# Altium schematic sheet 50.VO-HDMI2.1 TX.SchDoc
size 420 x 297 mm; Revision: V2.1; Schematic Page Number: 11; Page Number: 28; Check: <Checker>; Schematic Name: RK_NVR_DEMO1_RK3588_LP4/4x_V21; Page Count: 43; Page name: 50.VO-HDMI2.1 TX; Designer: Zhangdz; Schematic Page Count: 99; Revcode: V2.1; DsnPath: E:\Work\SBER\RK3588_SOM\temp\RK_NVR_DEMO1_RK3588_LP4XD200P232SD8_V21_20211228.DSN; SchematicName: RK_NVR_DEMO1_RK3588_LP4/4x_V21; PageName: 50.VO-HDMI2.1 TX; PageSize: A3; TopSchematic: True
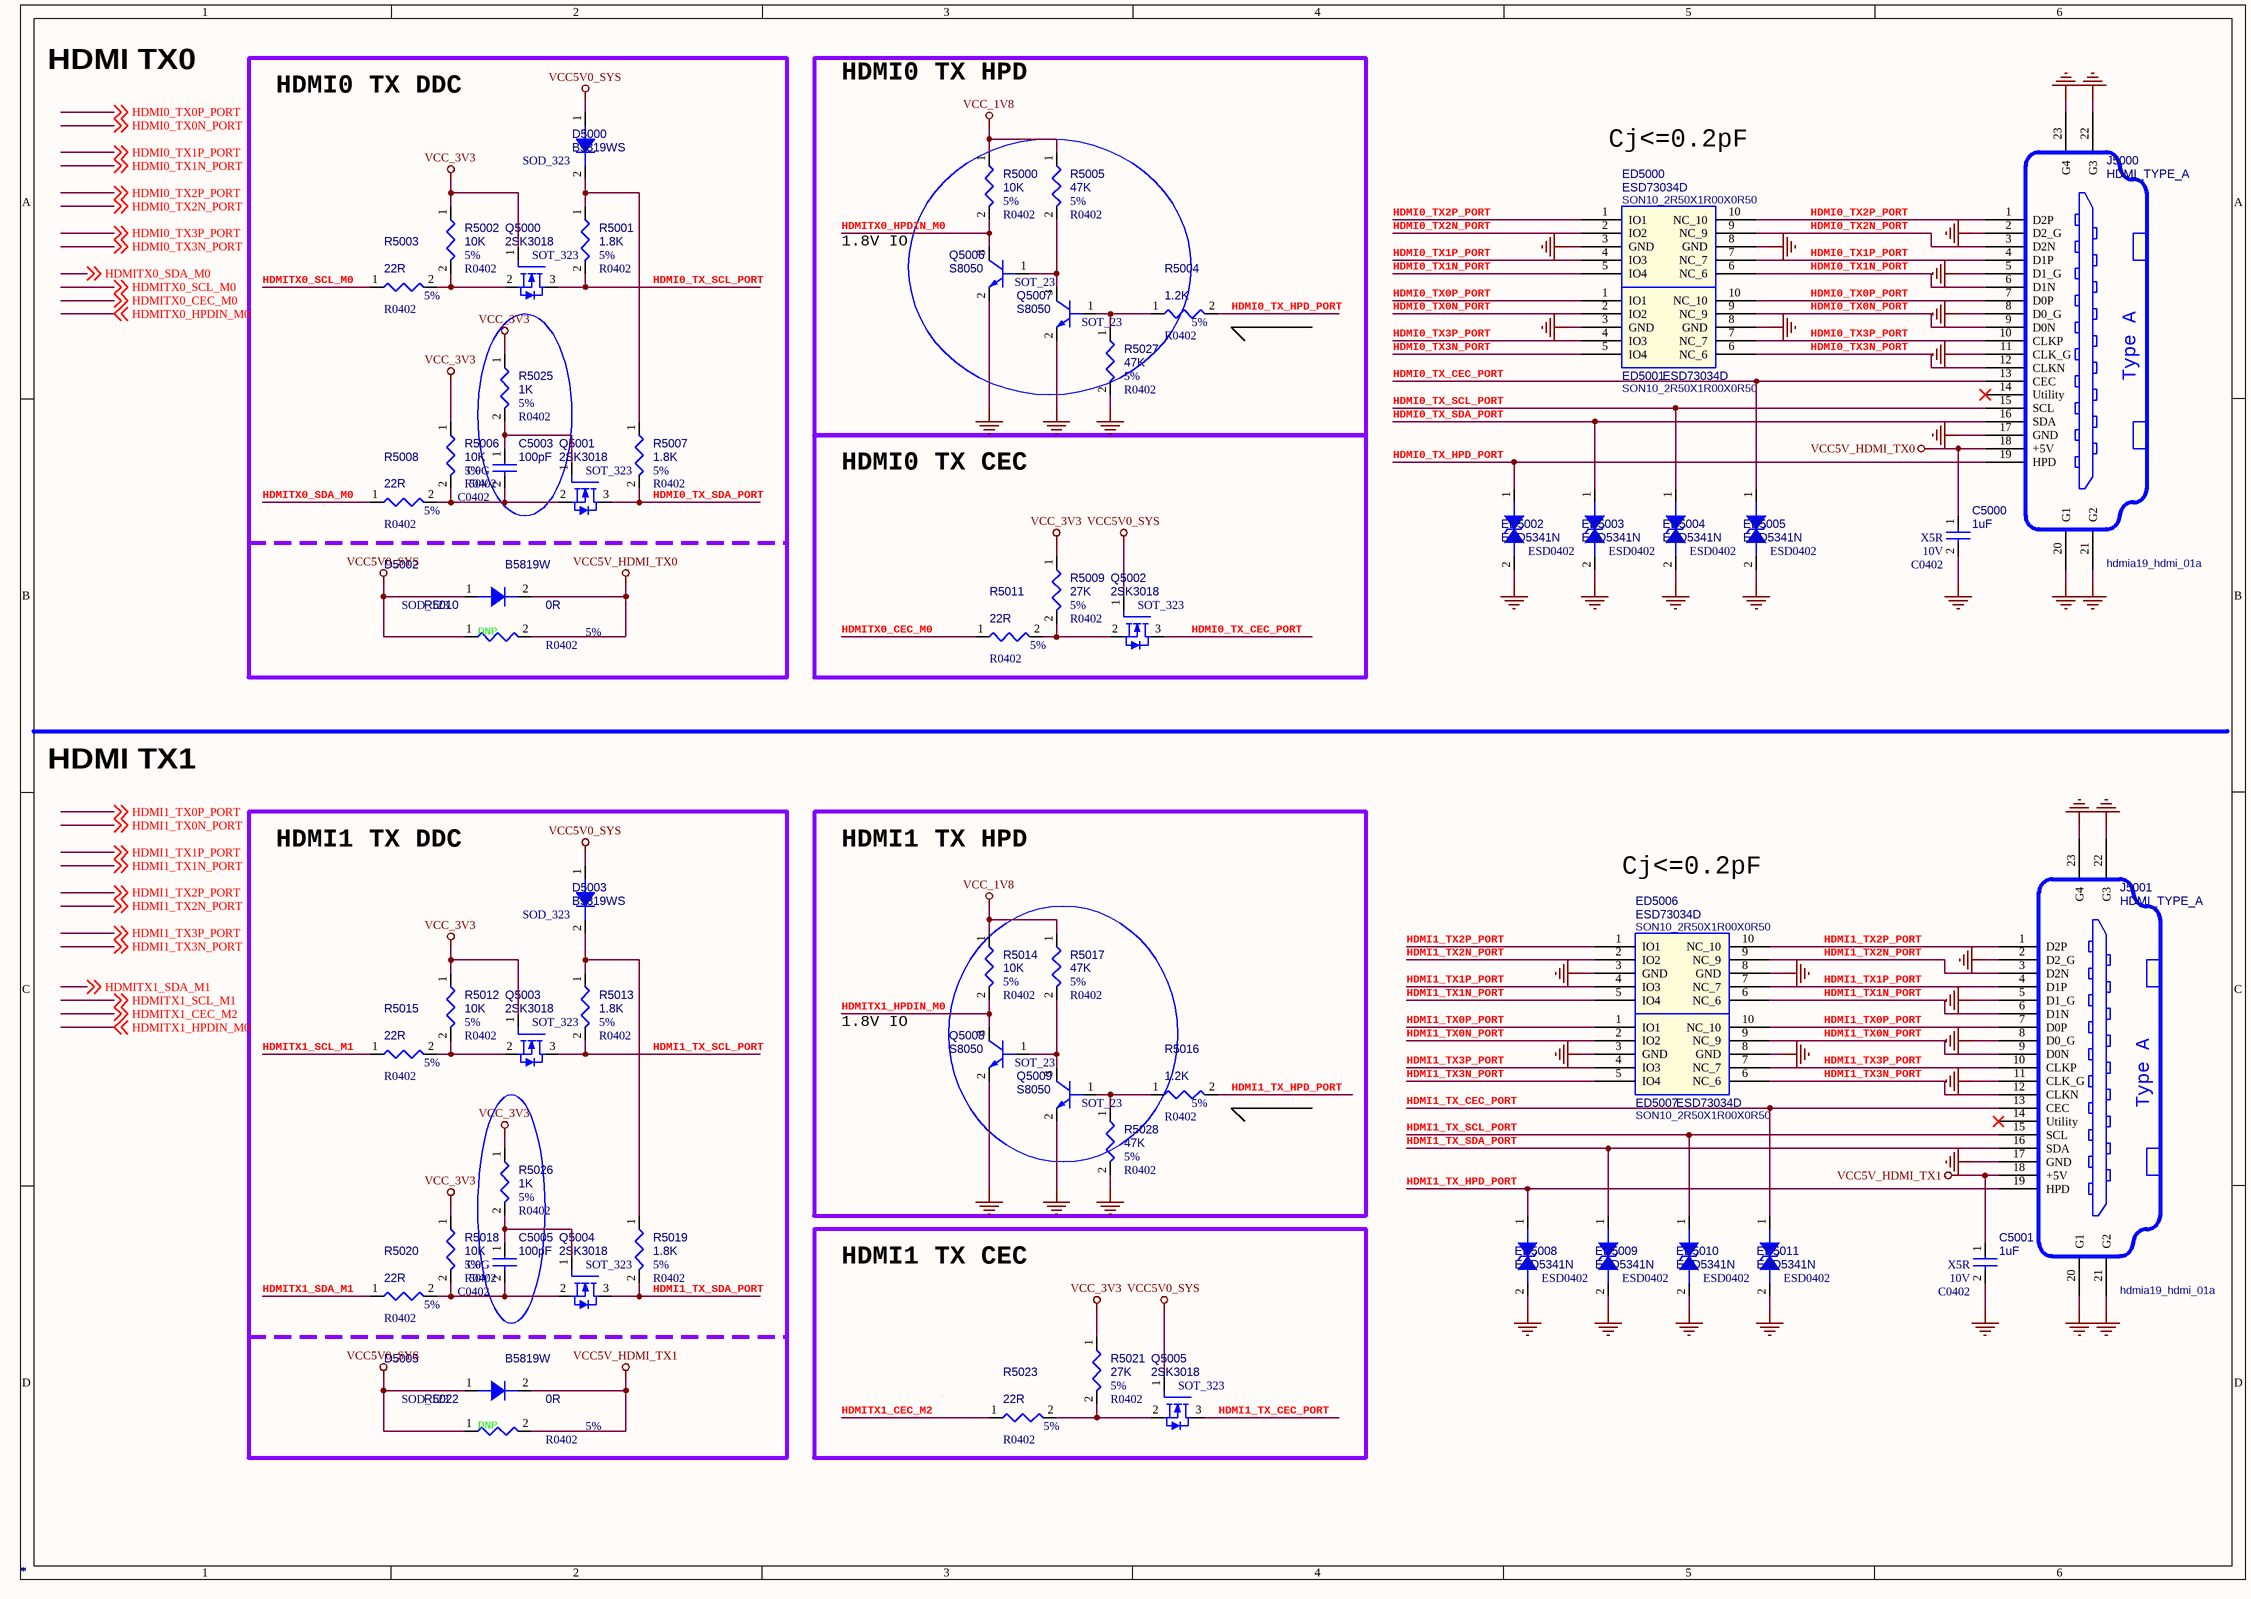
[diagram p0: 50.VO-HDMI2.1 TX.SchDoc]

## Parts
C5000  *  Voltage: 10V  Dielectric: X5R  [C0402]
C5001  *  Voltage: 10V  Dielectric: X5R  [C0402]
C5003  *  Voltage: 50V  Dielectric: C0G  [C0402]
C5005  *  Voltage: 50V  Dielectric: C0G  [C0402]
D5000  *  [SOD_323]
D5002  *  [SOD_123]
D5003  *  [SOD_323]
D5005  *  [SOD_123]
ED5000  *  [SON10_2R50X1R00X0R50]
ED5001  *  [SON10_2R50X1R00X0R50]
ED5002  *  [ESD0402]
ED5003  *  [ESD0402]
ED5004  *  [ESD0402]
ED5005  *  [ESD0402]
ED5006  *  [SON10_2R50X1R00X0R50]
ED5007  *  [SON10_2R50X1R00X0R50]
ED5008  *  [ESD0402]
ED5009  *  [ESD0402]
ED5010  *  [ESD0402]
ED5011  *  [ESD0402]
J5000  *  [hdmia19_hdmi_01a]
J5001  *  [hdmia19_hdmi_01a]
Q5000  *  PCB Footprint: SOT_323  [SOT23]
Q5001  *  PCB Footprint: SOT_323  [SOT23]
Q5002  *  PCB Footprint: SOT_323  [SOT23]
Q5003  *  PCB Footprint: SOT_323  [SOT23]
Q5004  *  PCB Footprint: SOT_323  [SOT23]
Q5005  *  PCB Footprint: SOT_323  [SOT23]
Q5006  *  [SOT_23]
Q5007  *  [SOT_23]
Q5008  *  [SOT_23]
Q5009  *  [SOT_23]
R5000  *  Tolerance: 5%  [R0402]
R5001  *  Tolerance: 5%  [R0402]
R5002  *  Tolerance: 5%  [R0402]
R5003  *  Tolerance: 5%  [R0402]
R5004  *  Tolerance: 5%  [R0402]
R5005  *  Tolerance: 5%  [R0402]
R5006  *  Tolerance: 5%  [R0402]
R5007  *  Tolerance: 5%  [R0402]
R5008  *  Tolerance: 5%  [R0402]
R5009  *  Tolerance: 5%  [R0402]
R5010  *  Tolerance: 5%  Option: DNP  [R0402]
R5011  *  Tolerance: 5%  [R0402]
R5012  *  Tolerance: 5%  [R0402]
R5013  *  Tolerance: 5%  [R0402]
R5014  *  Tolerance: 5%  [R0402]
R5015  *  Tolerance: 5%  [R0402]
R5016  *  Tolerance: 5%  [R0402]
R5017  *  Tolerance: 5%  [R0402]
R5018  *  Tolerance: 5%  [R0402]
R5019  *  Tolerance: 5%  [R0402]
R5020  *  Tolerance: 5%  [R0402]
R5021  *  Tolerance: 5%  [R0402]
R5022  *  Tolerance: 5%  Option: DNP  [R0402]
R5023  *  Tolerance: 5%  [R0402]
R5025  *  Tolerance: 5%  [R0402]
R5026  *  Tolerance: 5%  [R0402]
R5027  *  Tolerance: 5%  [R0402]
R5028  *  Tolerance: 5%  [R0402]

## Blocks framed on the sheet
HDMI0 TX DDC: C5003 D5000 D5002 Q5000 Q5001 R5001-R5003 R5006-R5008 R5010 R5025
HDMI0 TX HPD: Q5006 Q5007 R5000 R5004 R5005 R5027
HDMI0 TX CEC: Q5002 R5009 R5011
HDMI1 TX DDC: C5005 D5003 D5005 Q5003 Q5004 R5012 R5013 R5015 R5018-R5020 R5022 R5026
HDMI1 TX HPD: Q5008 Q5009 R5014 R5016 R5017 R5028
HDMI1 TX CEC: Q5005 R5021 R5023

## Nets
GND: C5000.2 C5001.2 ED5000.3(GND) ED5000.8(GND) ED5001.3(GND) ED5001.8(GND) ED5002.2 ED5003.2 ED5004.2 ED5005.2 ED5006.3(GND) ED5006.8(GND) ED5007.3(GND) ED5007.8(GND) ED5008.2 ED5009.2 ED5010.2 ED5011.2 J5000.2(D2_G) J5000.5(D1_G) J5000.8(D0_G) J5000.11(CLK_G) J5000.17(GND) J5000.20(G1) J5000.21(G2) J5000.22(G3) J5000.23(G4) J5001.2(D2_G) J5001.5(D1_G) J5001.8(D0_G) J5001.11(CLK_G) J5001.17(GND) J5001.20(G1) J5001.21(G2) J5001.22(G3) J5001.23(G4) Q5006.2(EMITTER) Q5007.2(EMITTER) Q5008.2(EMITTER) Q5009.2(EMITTER) R5027.2 R5028.2
VCC5V0_SYS: D5000.1(A) D5002.1(A) D5003.1(A) D5005.1(A) Q5002.1(GATE) Q5005.1(GATE) R5010.1 R5022.1
VCC5V_HDMI_TX0: C5000.1 D5002.2(K) J5000.18(+5V) R5010.2
VCC5V_HDMI_TX1: C5001.1 D5005.2(K) J5001.18(+5V) R5022.2
VCC_1V8: R5000.1 R5005.1 R5014.1 R5017.1
VCC_3V3: Q5000.1(GATE) Q5003.1(GATE) R5002.1 R5006.1 R5009.1 R5012.1 R5018.1 R5021.1 R5025.1 R5026.1
HDMI0_TX0N_PORT: ED5001.2(IO2) ED5001.9(NC_9) J5000.9(D0N) ; off-sheet HDMI0_TX0N_PORT
HDMI0_TX0P_PORT: ED5001.1(IO1) ED5001.10(NC_10) J5000.7(D0P) ; off-sheet HDMI0_TX0P_PORT
HDMI0_TX1N_PORT: ED5000.5(IO4) ED5000.6(NC_6) J5000.6(D1N) ; off-sheet HDMI0_TX1N_PORT
HDMI0_TX1P_PORT: ED5000.4(IO3) ED5000.7(NC_7) J5000.4(D1P) ; off-sheet HDMI0_TX1P_PORT
HDMI0_TX2N_PORT: ED5000.2(IO2) ED5000.9(NC_9) J5000.3(D2N) ; off-sheet HDMI0_TX2N_PORT
HDMI0_TX2P_PORT: ED5000.1(IO1) ED5000.10(NC_10) J5000.1(D2P) ; off-sheet HDMI0_TX2P_PORT
HDMI0_TX3N_PORT: ED5001.5(IO4) ED5001.6(NC_6) J5000.12(CLKN) ; off-sheet HDMI0_TX3N_PORT
HDMI0_TX3P_PORT: ED5001.4(IO3) ED5001.7(NC_7) J5000.10(CLKP) ; off-sheet HDMI0_TX3P_PORT
HDMI0_TX_CEC_PORT: ED5005.1 J5000.13(CEC) Q5002.3(DRAIN)
HDMI0_TX_HPD_PORT: ED5002.1 J5000.19(HPD) R5004.2
HDMI0_TX_SCL_PORT: ED5004.1 J5000.15(SCL) Q5000.3(DRAIN) R5001.2
HDMI0_TX_SDA_PORT: ED5003.1 J5000.16(SDA) Q5001.3(DRAIN) R5007.2
HDMI1_TX0N_PORT: ED5007.2(IO2) ED5007.9(NC_9) J5001.9(D0N) ; off-sheet HDMI1_TX0N_PORT
HDMI1_TX0P_PORT: ED5007.1(IO1) ED5007.10(NC_10) J5001.7(D0P) ; off-sheet HDMI1_TX0P_PORT
HDMI1_TX1N_PORT: ED5006.5(IO4) ED5006.6(NC_6) J5001.6(D1N) ; off-sheet HDMI1_TX1N_PORT
HDMI1_TX1P_PORT: ED5006.4(IO3) ED5006.7(NC_7) J5001.4(D1P) ; off-sheet HDMI1_TX1P_PORT
HDMI1_TX2N_PORT: ED5006.2(IO2) ED5006.9(NC_9) J5001.3(D2N) ; off-sheet HDMI1_TX2N_PORT
HDMI1_TX2P_PORT: ED5006.1(IO1) ED5006.10(NC_10) J5001.1(D2P) ; off-sheet HDMI1_TX2P_PORT
HDMI1_TX3N_PORT: ED5007.5(IO4) ED5007.6(NC_6) J5001.12(CLKN) ; off-sheet HDMI1_TX3N_PORT
HDMI1_TX3P_PORT: ED5007.4(IO3) ED5007.7(NC_7) J5001.10(CLKP) ; off-sheet HDMI1_TX3P_PORT
HDMI1_TX_CEC_PORT: ED5011.1 J5001.13(CEC) Q5005.3(DRAIN)
HDMI1_TX_HPD_PORT: ED5008.1 J5001.19(HPD) R5016.2
HDMI1_TX_SCL_PORT: ED5010.1 J5001.15(SCL) Q5003.3(DRAIN) R5013.2
HDMI1_TX_SDA_PORT: ED5009.1 J5001.16(SDA) Q5004.3(DRAIN) R5019.2
HDMITX0_CEC_M0: R5011.1 ; off-sheet HDMITX0_CEC_M0
HDMITX0_HPDIN_M0: Q5006.3(COLLECTOR) R5000.2 ; off-sheet HDMITX0_HPDIN_M0
HDMITX0_SCL_M0: R5003.1 ; off-sheet HDMITX0_SCL_M0
HDMITX0_SDA_M0: R5008.1 ; off-sheet HDMITX0_SDA_M0
HDMITX1_CEC_M2: R5023.1 ; off-sheet HDMITX1_CEC_M2
HDMITX1_HPDIN_M0: Q5008.3(COLLECTOR) R5014.2 ; off-sheet HDMITX1_HPDIN_M0
HDMITX1_SCL_M1: R5015.1 ; off-sheet HDMITX1_SCL_M1
HDMITX1_SDA_M1: R5020.1 ; off-sheet HDMITX1_SDA_M1
NetC5003_1: C5003.1 Q5001.1(GATE) R5025.2
NetC5003_2: C5003.2 Q5001.2(SOURCE) R5006.2 R5008.2
NetC5005_1: C5005.1 Q5004.1(GATE) R5026.2
NetC5005_2: C5005.2 Q5004.2(SOURCE) R5018.2 R5020.2
NetD5000_2: D5000.2(K) R5001.1 R5007.1
NetD5003_2: D5003.2(K) R5013.1 R5019.1
NetQ5000_2: Q5000.2(SOURCE) R5002.2 R5003.2
NetQ5002_2: Q5002.2(SOURCE) R5009.2 R5011.2
NetQ5003_2: Q5003.2(SOURCE) R5012.2 R5015.2
NetQ5005_2: Q5005.2(SOURCE) R5021.2 R5023.2
NetQ5006_1: Q5006.1(BASE) Q5007.3(COLLECTOR) R5005.2
NetQ5007_1: Q5007.1(BASE) R5004.1 R5027.1
NetQ5008_1: Q5008.1(BASE) Q5009.3(COLLECTOR) R5017.2
NetQ5009_1: Q5009.1(BASE) R5016.1 R5028.1

Not connected (* = marked no-connect by the designer): J5000 14(Utility)*; J5001 14(Utility)*

## Notes on the sheet
- HDMI TX0
- Cj<=0.2pF
- 1.8V IO
- HDMI TX1
- (in symbol HDMI_TYPE_A_0) Type A

## Library data of the parts
C5000 = CAP NP: cap,1.00uF,+/-10%,10V,X5R,C0402; Part Reference: C5000; Manufacturer PN: C1005X5R1A105K050BB; Manufacturer: TDK; Value: 1uF; Tolerance: 10%; Priority: A; Number: 37; PCB Footprint: C0402; Created by: JJJ; C_Voltage: 10V; Part Type: C0402; RK PN: C1005X5R1A105K050BB
C5001 = CAP NP: cap,1.00uF,+/-10%,10V,X5R,C0402; Part Reference: C5001; Manufacturer PN: C1005X5R1A105K050BB; Manufacturer: TDK; Value: 1uF; Tolerance: 10%; Priority: A; Number: 37; PCB Footprint: C0402; Created by: JJJ; C_Voltage: 10V; Part Type: C0402; RK PN: C1005X5R1A105K050BB
C5003 = CAP NP: cap,100.00pF,+/-10%,50V,C0G,C0402; Part Reference: C5003; Manufacturer: TDK; Value: 100pF; Number: 37; RK PN: C1005C0G1H101K050BA; Priority: A; Tolerance: 10%; C_Voltage: 10V; PCB Footprint: C0402; Part Type: C0402; Manufacturer PN: C1005C0G1H101K050BA; Created by: JJJ
C5005 = CAP NP: cap,100.00pF,+/-10%,50V,C0G,C0402; Part Reference: C5005; Manufacturer: TDK; Value: 100pF; Number: 37; RK PN: C1005C0G1H101K050BA; Priority: A; Tolerance: 10%; C_Voltage: 10V; PCB Footprint: C0402; Part Type: C0402; Manufacturer PN: C1005C0G1H101K050BA; Created by: JJJ
D5000 = DIODE: Schottky BarrierЈ¬B5819WS SOD-323; Part Reference: D5000; Manufacturer: і¤µз; Priority: A; PCB Footprint: SOD_323; Value: B5819WS; RK PN: B5819WS; Part Type: Schottky rectifier; Manufacturer PN: B5819WS; Created by: JJJ
D5002 = DIODE: Schottky BarrierЈ¬B5819W SOD-123; Part Reference: D5002; Manufacturer: і¤µз; Value: B5819W; Priority: A; PCB Footprint: SOD_123; RK PN: B5819W; Part Type: Schottky rectifier; Manufacturer PN: B5819W; Created by: JJJ
D5003 = DIODE: Schottky BarrierЈ¬B5819WS SOD-323; Part Reference: D5003; Manufacturer: і¤µз; Priority: A; PCB Footprint: SOD_323; Value: B5819WS; RK PN: B5819WS; Part Type: Schottky rectifier; Manufacturer PN: B5819WS; Created by: JJJ
D5005 = DIODE: Schottky BarrierЈ¬B5819W SOD-123; Part Reference: D5005; Manufacturer: і¤µз; Value: B5819W; Priority: A; PCB Footprint: SOD_123; RK PN: B5819W; Part Type: Schottky rectifier; Manufacturer PN: B5819W; Created by: JJJ
ED5000 = ESD_ESD5304D: 4-Lines, Uni-directional, Ultra-low Capacitance Transient Voltage Suppressors; Part Reference: ED5000; Manufacturer: WillSemi(О¤¶ы°лµјМе); Value: ESD73034D; Priority: A; PCB Footprint: SON10_2R50X1R00X0R50; RK PN: ESD5304D; Part Type: ESD_TVS; Manufacturer PN: ESD5304D; Created by: JJJ
ED5001 = ESD_ESD5304D: 4-Lines, Uni-directional, Ultra-low Capacitance Transient Voltage Suppressors; Part Reference: ED5001; Manufacturer: WillSemi(О¤¶ы°лµјМе); Value: ESD73034D; Priority: A; PCB Footprint: SON10_2R50X1R00X0R50; Created by: JJJ; Manufacturer PN: ESD5304D; Part Type: ESD_TVS; RK PN: ESD5304D
ED5002 = DIODE BI_DIR TRIG: 1-Line, Bi-directional, Transient Voltage Suppressors.1pF.; Part Reference: ED5002; Manufacturer: WillSemi(О¤¶ы°лµјМе); Value: ESD5341N; Priority: A; PCB Footprint: ESD0402; Created by: JJJ; Manufacturer PN: ESD5341N; Part Type: ESD_TVS; RK PN: ESD5341N
ED5003 = DIODE BI_DIR TRIG: 1-Line, Bi-directional, Transient Voltage Suppressors.1pF.; Part Reference: ED5003; Manufacturer: WillSemi(О¤¶ы°лµјМе); Value: ESD5341N; Priority: A; PCB Footprint: ESD0402; Created by: JJJ; Manufacturer PN: ESD5341N; Part Type: ESD_TVS; RK PN: ESD5341N
ED5004 = DIODE BI_DIR TRIG: 1-Line, Bi-directional, Transient Voltage Suppressors.1pF.; Part Reference: ED5004; Manufacturer: WillSemi(О¤¶ы°лµјМе); Value: ESD5341N; Priority: A; PCB Footprint: ESD0402; Created by: JJJ; Manufacturer PN: ESD5341N; Part Type: ESD_TVS; RK PN: ESD5341N
ED5005 = DIODE BI_DIR TRIG: 1-Line, Bi-directional, Transient Voltage Suppressors.1pF.; Part Reference: ED5005; Manufacturer: WillSemi(О¤¶ы°лµјМе); Value: ESD5341N; Priority: A; PCB Footprint: ESD0402; Created by: JJJ; Manufacturer PN: ESD5341N; Part Type: ESD_TVS; RK PN: ESD5341N
ED5006 = ESD_ESD5304D: 4-Lines, Uni-directional, Ultra-low Capacitance Transient Voltage Suppressors; Part Reference: ED5006; Manufacturer: WillSemi(О¤¶ы°лµјМе); Value: ESD73034D; Priority: A; PCB Footprint: SON10_2R50X1R00X0R50; RK PN: ESD5304D; Part Type: ESD_TVS; Manufacturer PN: ESD5304D; Created by: JJJ
ED5007 = ESD_ESD5304D: 4-Lines, Uni-directional, Ultra-low Capacitance Transient Voltage Suppressors; Part Reference: ED5007; Manufacturer: WillSemi(О¤¶ы°лµјМе); Value: ESD73034D; Priority: A; PCB Footprint: SON10_2R50X1R00X0R50; Created by: JJJ; Manufacturer PN: ESD5304D; Part Type: ESD_TVS; RK PN: ESD5304D
ED5008 = DIODE BI_DIR TRIG: 1-Line, Bi-directional, Transient Voltage Suppressors.1pF.; Part Reference: ED5008; Manufacturer: WillSemi(О¤¶ы°лµјМе); Value: ESD5341N; Priority: A; PCB Footprint: ESD0402; RK PN: ESD5341N; Part Type: ESD_TVS; Manufacturer PN: ESD5341N; Created by: JJJ
ED5009 = DIODE BI_DIR TRIG: 1-Line, Bi-directional, Transient Voltage Suppressors.1pF.; Part Reference: ED5009; Manufacturer: WillSemi(О¤¶ы°лµјМе); Value: ESD5341N; Priority: A; PCB Footprint: ESD0402; RK PN: ESD5341N; Part Type: ESD_TVS; Manufacturer PN: ESD5341N; Created by: JJJ
ED5010 = DIODE BI_DIR TRIG: 1-Line, Bi-directional, Transient Voltage Suppressors.1pF.; Part Reference: ED5010; Manufacturer: WillSemi(О¤¶ы°лµјМе); Value: ESD5341N; Priority: A; PCB Footprint: ESD0402; RK PN: ESD5341N; Part Type: ESD_TVS; Manufacturer PN: ESD5341N; Created by: JJJ
ED5011 = DIODE BI_DIR TRIG: 1-Line, Bi-directional, Transient Voltage Suppressors.1pF.; Part Reference: ED5011; Manufacturer: WillSemi(О¤¶ы°лµјМе); Value: ESD5341N; Priority: A; PCB Footprint: ESD0402; RK PN: ESD5341N; Part Type: ESD_TVS; Manufacturer PN: ESD5341N; Created by: JJJ
J5000 = HDMI_TYPE_A_0: Part Reference: J5000; Value: HDMI_TYPE_A; PCB Footprint: hdmia19_hdmi_01a
J5001 = HDMI_TYPE_A_0: Part Reference: J5001; Value: HDMI_TYPE_A; PCB Footprint: hdmia19_hdmi_01a
Q5000 = MOSFET N: NMOS,2SK3018,SOT_323,Id=0.1A,Vds=30V; Part Reference: Q5000; Manufacturer: ROHM; Rds: 5ohm; Priority: A; Id_max: 0.1A; Vgs: 20V; VDS: 30V; Vgsth: 1.5V; Pd: 0.2W; Value: 2SK3018; RK PN: 2SK3018; Part Type: NMOS; Manufacturer PN: 2SK3018; Created by: JJJ
Q5001 = MOSFET N: NMOS,2SK3018,SOT_323,Id=0.1A,Vds=30V; Part Reference: Q5001; Manufacturer: ROHM; Rds: 5ohm; Priority: A; Id_max: 0.1A; Vgs: 20V; VDS: 30V; Vgsth: 1.5V; Pd: 0.2W; Value: 2SK3018; RK PN: 2SK3018; Part Type: NMOS; Manufacturer PN: 2SK3018; Created by: JJJ
Q5002 = MOSFET N: NMOS,2SK3018,SOT_323,Id=0.1A,Vds=30V; Part Reference: Q5002; Manufacturer: ROHM; Pd: 0.2W; Vgsth: 1.5V; VDS: 30V; Vgs: 20V; Id_max: 0.1A; Priority: A; Rds: 5ohm; Value: 2SK3018; Created by: JJJ; Manufacturer PN: 2SK3018; Part Type: NMOS; RK PN: 2SK3018
Q5003 = MOSFET N: NMOS,2SK3018,SOT_323,Id=0.1A,Vds=30V; Part Reference: Q5003; Manufacturer: ROHM; Rds: 5ohm; Priority: A; Id_max: 0.1A; Vgs: 20V; VDS: 30V; Vgsth: 1.5V; Pd: 0.2W; Value: 2SK3018; RK PN: 2SK3018; Part Type: NMOS; Manufacturer PN: 2SK3018; Created by: JJJ
Q5004 = MOSFET N: NMOS,2SK3018,SOT_323,Id=0.1A,Vds=30V; Part Reference: Q5004; Manufacturer: ROHM; Rds: 5ohm; Priority: A; Id_max: 0.1A; Vgs: 20V; VDS: 30V; Vgsth: 1.5V; Pd: 0.2W; Value: 2SK3018; RK PN: 2SK3018; Part Type: NMOS; Manufacturer PN: 2SK3018; Created by: JJJ
Q5005 = MOSFET N: NMOS,2SK3018,SOT_323,Id=0.1A,Vds=30V; Part Reference: Q5005; Manufacturer: ROHM; Rds: 5ohm; Priority: A; Id_max: 0.1A; Vgs: 20V; VDS: 30V; Vgsth: 1.5V; Pd: 0.2W; Value: 2SK3018; RK PN: 2SK3018; Part Type: NMOS; Manufacturer PN: 2SK3018; Created by: JJJ
Q5006 = NPN: S8050,SOT23; Part Reference: Q5006; Manufacturer PN: S8050_SOT23; Manufacturer: і¤µз; Pc: 0.3W; Vceo: 25V; Ic: 0.5A; Priority: A; PCB Footprint: SOT_23; Value: S8050; Created by: JJJ; Part Type: NPN; RK PN: S8050
Q5007 = NPN: S8050,SOT23; Part Reference: Q5007; Manufacturer PN: S8050_SOT23; Manufacturer: і¤µз; Pc: 0.3W; Vceo: 25V; Ic: 0.5A; Priority: A; PCB Footprint: SOT_23; Value: S8050; Created by: JJJ; Part Type: NPN; RK PN: S8050
Q5008 = NPN: S8050,SOT23; Part Reference: Q5008; Manufacturer PN: S8050_SOT23; Manufacturer: і¤µз; Pc: 0.3W; Vceo: 25V; Ic: 0.5A; Priority: A; PCB Footprint: SOT_23; Value: S8050; Created by: JJJ; Part Type: NPN; RK PN: S8050
Q5009 = NPN: S8050,SOT23; Part Reference: Q5009; Manufacturer PN: S8050_SOT23; Manufacturer: і¤µз; Pc: 0.3W; Vceo: 25V; Ic: 0.5A; Priority: A; PCB Footprint: SOT_23; Value: S8050; Created by: JJJ; Part Type: NPN; RK PN: S8050
R5000 = RESISTOR_Dup1: НЁУГєсД¤µзЧи,10K,+/-5%,R0402,1/16W.; Part Reference: R5000; Manufacturer: YAGEO; RK PN: RC0402JR-0710KL; Priority: A; Wattage: 1/16W; PCB Footprint: R0402; Value: 10K; Part Type: НЁУГєсД¤µзЧи; Manufacturer PN: RC0402JR-0710KL; Created by: YTL
R5001 = RESISTOR_Dup1: НЁУГєсД¤µзЧи,1K8,+/-5%,R0402,1/16W.; Part Reference: R5001; Manufacturer PN: RC0402JR-071K8L; Manufacturer: YAGEO; Value: 1.8K; Wattage: 1/16W; Priority: A; PCB Footprint: R0402; Created by: YTL; Part Type: НЁУГєсД¤µзЧи; RK PN: RC0402JR-071K8L
R5002 = RESISTOR_Dup1: НЁУГєсД¤µзЧи,10K,+/-5%,R0402,1/16W.; Part Reference: R5002; Manufacturer PN: RC0402JR-0710KL; Manufacturer: YAGEO; Wattage: 1/16W; Priority: A; PCB Footprint: R0402; Value: 10K; Created by: YTL; Part Type: НЁУГєсД¤µзЧи; RK PN: RC0402JR-0710KL
R5003 = RESISTOR_Dup1: НЁУГєсД¤µзЧи,22R,+/-5%,R0402,1/16W.; Part Reference: R5003; Manufacturer PN: RC0402JR-0722RL; Manufacturer: YAGEO; Wattage: 1/16W; Priority: A; PCB Footprint: R0402; Value: 22R; Created by: YTL; Part Type: НЁУГєсД¤µзЧи; RK PN: RC0402JR-0722RL
R5004 = RESISTOR_Dup1: НЁУГєсД¤µзЧи,1K2,+/-5%,R0402,1/16W.; Part Reference: R5004; Manufacturer: YAGEO; Value: 1.2K; RK PN: RC0402JR-071K2L; Priority: A; Wattage: 1/16W; PCB Footprint: R0402; Part Type: НЁУГєсД¤µзЧи; Manufacturer PN: RC0402JR-071K2L; Created by: YTL
R5005 = RESISTOR_Dup1: НЁУГєсД¤µзЧи,47K,+/-5%,R0402,1/16W.; Part Reference: R5005; Manufacturer PN: RC0402JR-0747KL; Manufacturer: YAGEO; Wattage: 1/16W; Priority: A; PCB Footprint: R0402; Value: 47K; Created by: YTL; Part Type: НЁУГєсД¤µзЧи; RK PN: RC0402JR-0747KL
R5006 = RESISTOR_Dup1: НЁУГєсД¤µзЧи,10K,+/-5%,R0402,1/16W.; Part Reference: R5006; Manufacturer PN: RC0402JR-0710KL; Manufacturer: YAGEO; Wattage: 1/16W; Priority: A; PCB Footprint: R0402; Value: 10K; Created by: YTL; Part Type: НЁУГєсД¤µзЧи; RK PN: RC0402JR-0710KL
R5007 = RESISTOR_Dup1: НЁУГєсД¤µзЧи,1K8,+/-5%,R0402,1/16W.; Part Reference: R5007; Manufacturer PN: RC0402JR-071K8L; Manufacturer: YAGEO; Value: 1.8K; Wattage: 1/16W; Priority: A; PCB Footprint: R0402; Created by: YTL; Part Type: НЁУГєсД¤µзЧи; RK PN: RC0402JR-071K8L
R5008 = RESISTOR_Dup1: НЁУГєсД¤µзЧи,22R,+/-5%,R0402,1/16W.; Part Reference: R5008; Manufacturer: YAGEO; RK PN: RC0402JR-0722RL; Priority: A; Wattage: 1/16W; PCB Footprint: R0402; Value: 22R; Part Type: НЁУГєсД¤µзЧи; Manufacturer PN: RC0402JR-0722RL; Created by: YTL
R5009 = RESISTOR_Dup1: НЁУГєсД¤µзЧи,27K,+/-5%,R0402,1/16W.; Part Reference: R5009; Manufacturer PN: RC0402JR-0727KL; Manufacturer: YAGEO; Wattage: 1/16W; Priority: A; PCB Footprint: R0402; Value: 27K; Created by: YTL; Part Type: НЁУГєсД¤µзЧи; RK PN: RC0402JR-0727KL
R5010 = RESISTOR_Dup1: НЁУГєсД¤µзЧи,0R,+/-5%,R0402,1/16W.; Part Reference: R5010; Manufacturer: YAGEO; RK PN: RC0402JR-070RL; Priority: A; Wattage: 1/16W; PCB Footprint: R0402; Value: 0R; Part Type: НЁУГєсД¤µзЧи; Manufacturer PN: RC0402JR-070RL; Created by: YTL
R5011 = RESISTOR_Dup1: НЁУГєсД¤µзЧи,22R,+/-5%,R0402,1/16W.; Part Reference: R5011; Manufacturer PN: RC0402JR-0722RL; Manufacturer: YAGEO; Wattage: 1/16W; Priority: A; PCB Footprint: R0402; Value: 22R; Created by: YTL; Part Type: НЁУГєсД¤µзЧи; RK PN: RC0402JR-0722RL
R5012 = RESISTOR_Dup1: НЁУГєсД¤µзЧи,10K,+/-5%,R0402,1/16W.; Part Reference: R5012; Manufacturer PN: RC0402JR-0710KL; Manufacturer: YAGEO; Wattage: 1/16W; Priority: A; PCB Footprint: R0402; Value: 10K; Created by: YTL; Part Type: НЁУГєсД¤µзЧи; RK PN: RC0402JR-0710KL
R5013 = RESISTOR_Dup1: НЁУГєсД¤µзЧи,1K8,+/-5%,R0402,1/16W.; Part Reference: R5013; Manufacturer PN: RC0402JR-071K8L; Manufacturer: YAGEO; Value: 1.8K; Wattage: 1/16W; Priority: A; PCB Footprint: R0402; Created by: YTL; Part Type: НЁУГєсД¤µзЧи; RK PN: RC0402JR-071K8L
R5014 = RESISTOR_Dup1: НЁУГєсД¤µзЧи,10K,+/-5%,R0402,1/16W.; Part Reference: R5014; Manufacturer: YAGEO; RK PN: RC0402JR-0710KL; Priority: A; Wattage: 1/16W; PCB Footprint: R0402; Value: 10K; Part Type: НЁУГєсД¤µзЧи; Manufacturer PN: RC0402JR-0710KL; Created by: YTL
R5015 = RESISTOR_Dup1: НЁУГєсД¤µзЧи,22R,+/-5%,R0402,1/16W.; Part Reference: R5015; Manufacturer: YAGEO; RK PN: RC0402JR-0722RL; Priority: A; Wattage: 1/16W; PCB Footprint: R0402; Value: 22R; Part Type: НЁУГєсД¤µзЧи; Manufacturer PN: RC0402JR-0722RL; Created by: YTL
R5016 = RESISTOR_Dup1: НЁУГєсД¤µзЧи,1K2,+/-5%,R0402,1/16W.; Part Reference: R5016; Manufacturer: YAGEO; Value: 1.2K; RK PN: RC0402JR-071K2L; Priority: A; Wattage: 1/16W; PCB Footprint: R0402; Part Type: НЁУГєсД¤µзЧи; Manufacturer PN: RC0402JR-071K2L; Created by: YTL
R5017 = RESISTOR_Dup1: НЁУГєсД¤µзЧи,47K,+/-5%,R0402,1/16W.; Part Reference: R5017; Manufacturer PN: RC0402JR-0747KL; Manufacturer: YAGEO; Wattage: 1/16W; Priority: A; PCB Footprint: R0402; Value: 47K; Created by: YTL; Part Type: НЁУГєсД¤µзЧи; RK PN: RC0402JR-0747KL
R5018 = RESISTOR_Dup1: НЁУГєсД¤µзЧи,10K,+/-5%,R0402,1/16W.; Part Reference: R5018; Manufacturer: YAGEO; RK PN: RC0402JR-0710KL; Priority: A; Wattage: 1/16W; PCB Footprint: R0402; Value: 10K; Part Type: НЁУГєсД¤µзЧи; Manufacturer PN: RC0402JR-0710KL; Created by: YTL
R5019 = RESISTOR_Dup1: НЁУГєсД¤µзЧи,1K8,+/-5%,R0402,1/16W.; Part Reference: R5019; Manufacturer: YAGEO; Value: 1.8K; RK PN: RC0402JR-071K8L; Priority: A; Wattage: 1/16W; PCB Footprint: R0402; Part Type: НЁУГєсД¤µзЧи; Manufacturer PN: RC0402JR-071K8L; Created by: YTL
R5020 = RESISTOR_Dup1: НЁУГєсД¤µзЧи,22R,+/-5%,R0402,1/16W.; Part Reference: R5020; Manufacturer PN: RC0402JR-0722RL; Manufacturer: YAGEO; Wattage: 1/16W; Priority: A; PCB Footprint: R0402; Value: 22R; Created by: YTL; Part Type: НЁУГєсД¤µзЧи; RK PN: RC0402JR-0722RL
R5021 = RESISTOR_Dup1: НЁУГєсД¤µзЧи,27K,+/-5%,R0402,1/16W.; Part Reference: R5021; Manufacturer PN: RC0402JR-0727KL; Manufacturer: YAGEO; Wattage: 1/16W; Priority: A; PCB Footprint: R0402; Value: 27K; Created by: YTL; Part Type: НЁУГєсД¤µзЧи; RK PN: RC0402JR-0727KL
R5022 = RESISTOR_Dup1: НЁУГєсД¤µзЧи,0R,+/-5%,R0402,1/16W.; Part Reference: R5022; Manufacturer: YAGEO; RK PN: RC0402JR-070RL; Priority: A; Wattage: 1/16W; PCB Footprint: R0402; Value: 0R; Part Type: НЁУГєсД¤µзЧи; Manufacturer PN: RC0402JR-070RL; Created by: YTL
R5023 = RESISTOR_Dup1: НЁУГєсД¤µзЧи,22R,+/-5%,R0402,1/16W.; Part Reference: R5023; Manufacturer: YAGEO; RK PN: RC0402JR-0722RL; Priority: A; Wattage: 1/16W; PCB Footprint: R0402; Value: 22R; Part Type: НЁУГєсД¤µзЧи; Manufacturer PN: RC0402JR-0722RL; Created by: YTL
R5025 = RESISTOR_Dup1: НЁУГєсД¤µзЧи,1K,+/-5%,R0402,1/16W.; Part Reference: R5025; Manufacturer PN: RC0402JR-071KL; Manufacturer: YAGEO; Wattage: 1/16W; Priority: A; PCB Footprint: R0402; Value: 1K; Created by: YTL; Part Type: НЁУГєсД¤µзЧи; RK PN: RC0402JR-071KL
R5026 = RESISTOR_Dup1: НЁУГєсД¤µзЧи,1K,+/-5%,R0402,1/16W.; Part Reference: R5026; Manufacturer PN: RC0402JR-071KL; Manufacturer: YAGEO; Wattage: 1/16W; Priority: A; PCB Footprint: R0402; Value: 1K; Created by: YTL; Part Type: НЁУГєсД¤µзЧи; RK PN: RC0402JR-071KL
R5027 = RESISTOR_Dup1: НЁУГєсД¤µзЧи,47K,+/-5%,R0402,1/16W.; Part Reference: R5027; Manufacturer PN: RC0402JR-0747KL; Manufacturer: YAGEO; Wattage: 1/16W; Priority: A; PCB Footprint: R0402; Value: 47K; Created by: YTL; Part Type: НЁУГєсД¤µзЧи; RK PN: RC0402JR-0747KL
R5028 = RESISTOR_Dup1: НЁУГєсД¤µзЧи,47K,+/-5%,R0402,1/16W.; Part Reference: R5028; Manufacturer PN: RC0402JR-0747KL; Manufacturer: YAGEO; Wattage: 1/16W; Priority: A; PCB Footprint: R0402; Value: 47K; Created by: YTL; Part Type: НЁУГєсД¤µзЧи; RK PN: RC0402JR-0747KL